# Altium schematic sheet Title.SchDoc
size B; DocumentNumber: 1; SheetNumber: 1; SheetTotal: 3; ENG_APP_DATE: --/--/--; DSN_APP_DATE: --/--/--; CHK_APP_DATE: --/--/--
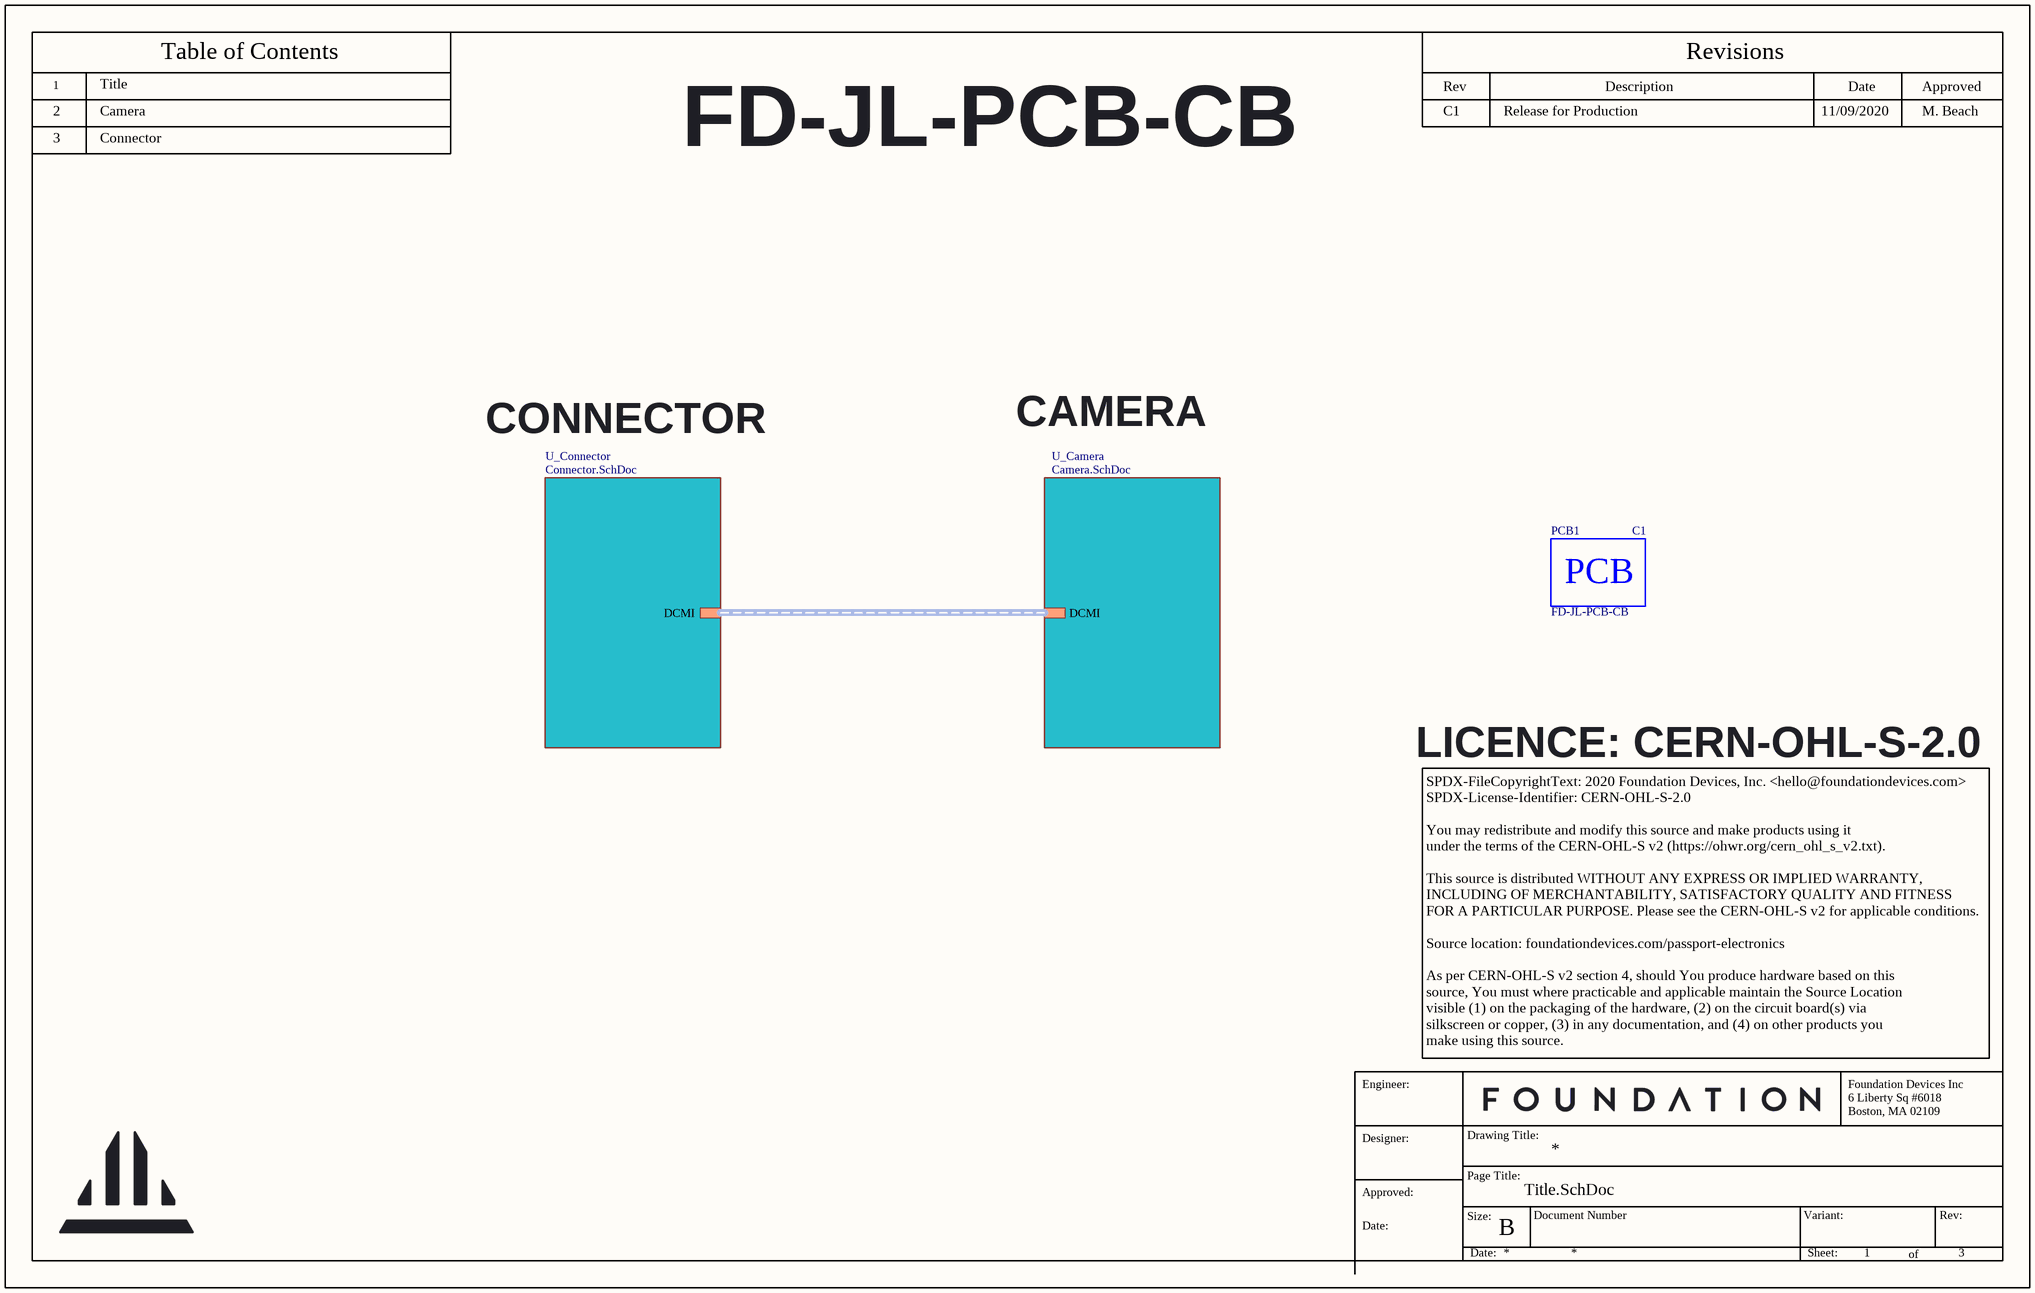
[diagram p0: Title.SchDoc]

## Parts
PCB1  FD-JL-PCB-CB  Rev: C1  (mechanical)

## Sub-sheets
U_Camera = Camera.SchDoc: DCMI (harness DCMI)
U_Connector = Connector.SchDoc: DCMI (harness DCMI)

## Buses and harness runs
harness sheet U_Camera/DCMI = sheet U_Connector/DCMI

## Notes on the sheet
- Title
- 2
- 3
- Camera
- Connector
- FD-JL-PCB-CB
- C1
- Release for Production
- 11/09/2020
- M. Beach
- CAMERA
- CONNECTOR
- LICENCE: CERN-OHL-S-2.0
- SPDX-FileCopyrightText: 2020 Foundation Devices, Inc. <hello@foundationdevices.com>
  SPDX-License-Identifier: CERN-OHL-S-2.0
  You may redistribute and modify this source and make products using it
  under the terms of the CERN-OHL-S v2 (https://ohwr.org/cern_ohl_s_v2.txt).
  This source is distributed WITHOUT ANY EXPRESS OR IMPLIED WARRANTY,
  INCLUDING OF MERCHANTABILITY, SATISFACTORY QUALITY AND FITNESS
  FOR A PARTICULAR PURPOSE. Please see the CERN-OHL-S v2 for applicable conditions.
  Source location: foundationdevices.com/passport-electronics
  As per CERN-OHL-S v2 section 4, should You produce hardware based on this
  source, You must where practicable and applicable maintain the Source Location
  visible (1) on the packaging of the hardware, (2) on the circuit board(s) via
  silkscreen or copper, (3) in any documentation, and (4) on other products you
  make using this source.
- 1
- Table of Contents
- Rev
- Description
- Revisions
- Date
- Approved
- Engineer:
- Foundation Devices Inc
- 6 Liberty Sq #6018
- Designer:
- Drawing Title:
- Page Title:
- Boston, MA 02109
- Approved:
- Date:
- Size:
- B
- Document Number
- Variant:
- Rev:
- Sheet:
- of

## Library data of the parts
PCB1 = CMP-MISC-00003-3: PCB - Juliet - Camera Board